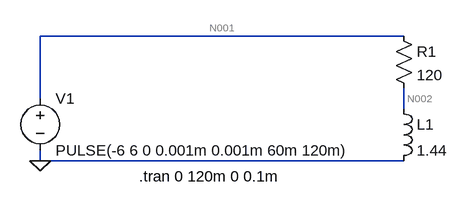
[diagram p0: schematic Draft2.asc]
Draft2.asc, the LTspice schematic file:
Version 4.1
SHEET 1 880 680
WIRE 464 -16 -96 -16
WIRE -96 80 -96 -16
WIRE 464 96 464 64
WIRE -96 176 -96 160
WIRE 464 176 -96 176
FLAG -96 176 0
SYMBOL voltage -96 64 R0
WINDOW 123 0 0 Left 0
WINDOW 39 0 0 Left 0
SYMATTR InstName V1
SYMATTR Value PULSE(-6 6 0 0.001m 0.001m 60m 120m)
SYMBOL res 448 -32 R0
SYMATTR InstName R1
SYMATTR Value 120
SYMBOL ind 448 80 R0
SYMATTR InstName L1
SYMATTR Value 1.44
SYMATTR SpiceLine Rser=0
TEXT 56 200 Left 2 !.tran 0 120m 0 0.1m

The netlist it stands for:
* Draft2.asc
V1 N001 0 PULSE(-6 6 0 0.001m 0.001m 60m 120m)
R1 N001 N002 120
L1 N002 0 1.44 Rser=0
.tran 0 120m 0 0.1m
.backanno
.end

* Results of the author's LTspice run, read from the files saved beside the schematic
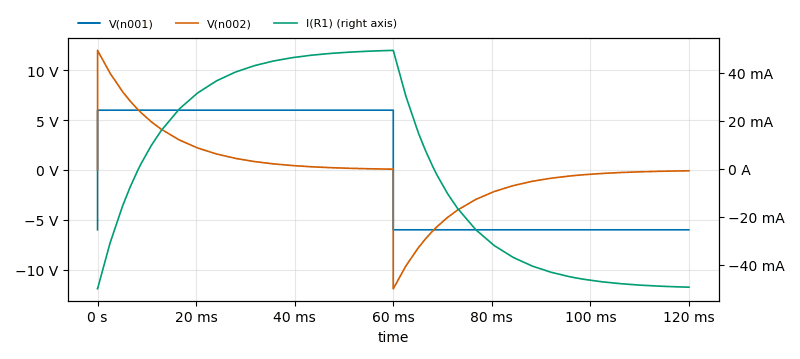
[diagram p1: Transient Analysis of Draft2.asc, plotted from the saved traces]
* Transient Analysis, 1 run:
*   V(n001): min -6 V, max 6 V, average 100 µV, rms 6 V, last -6 V
*   V(n002): min -11.92 V, max 12 V, average 8.152 mV, rms 3.809 V, last -80.32 mV
*   I(R1): min -50 mA, max 49.33 mA, average -67.1 µA, rms 38.97 mA, last -49.33 mA